# Altium project PCB_Project1.PrjPCB
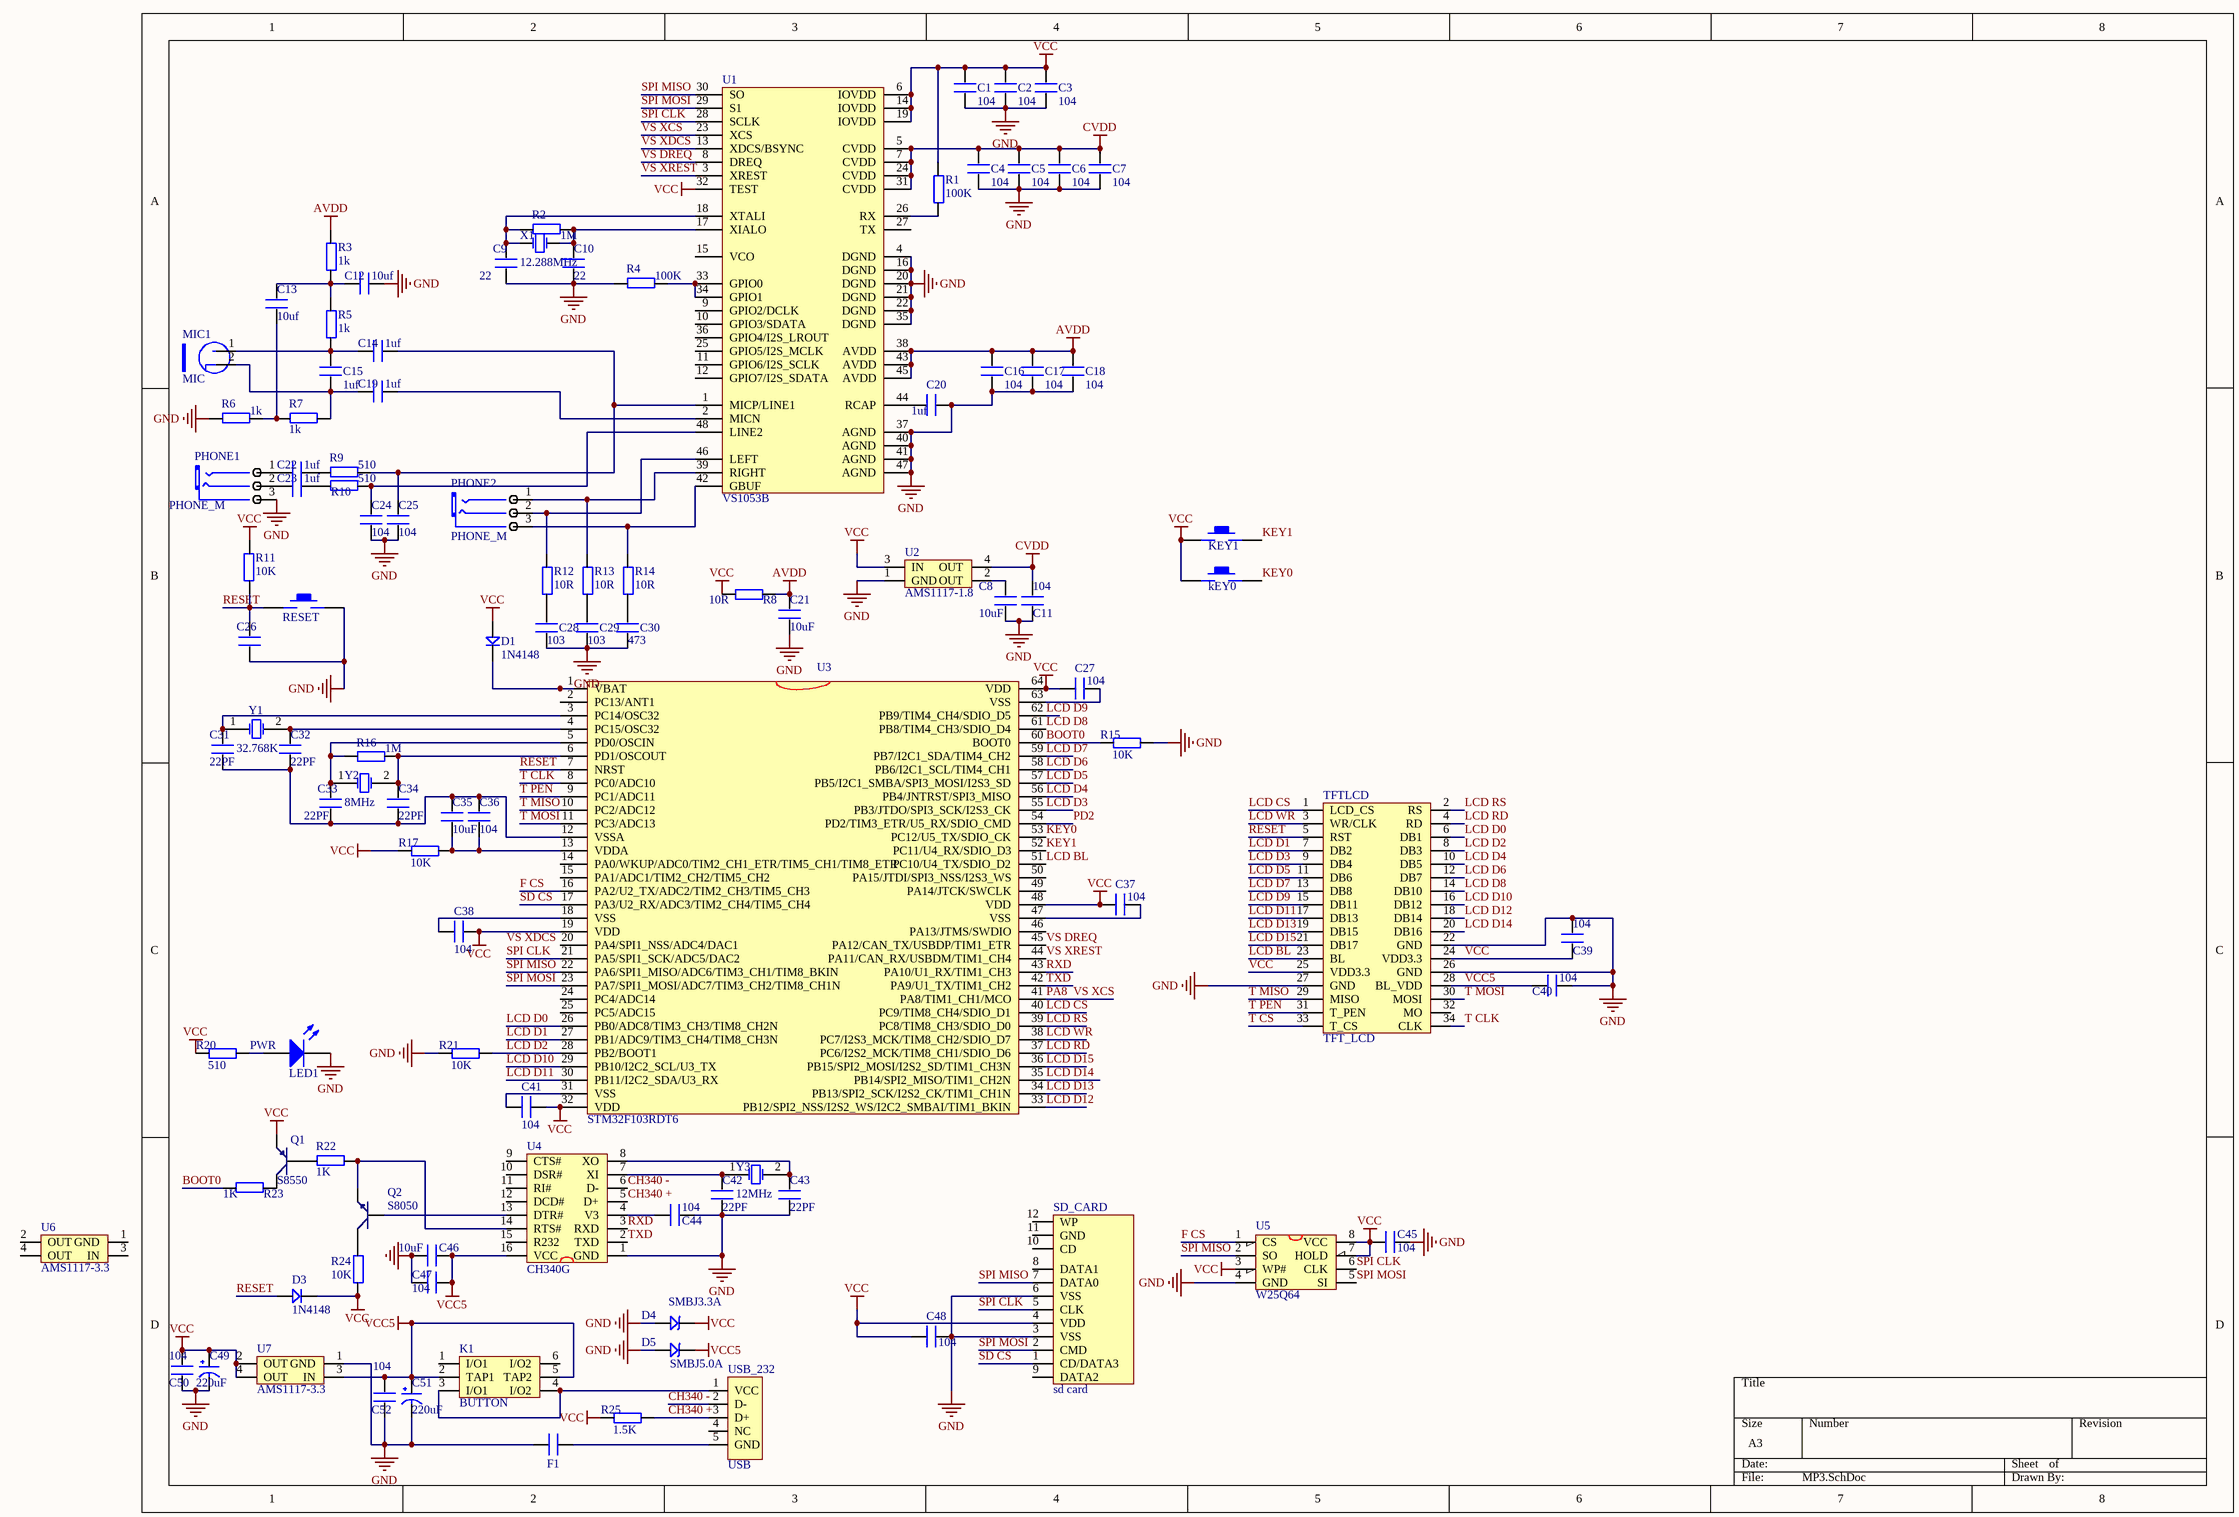
[diagram p0: MP3.SchDoc]
1 sheet, 104 parts. Net scope: global (net labels, ports and power ports of the same name join across sheets).
Board file: MCU.PcbDoc

## Sheet MP3.SchDoc
size A3

### Parts
C1  104  [0603P]
C2  104  [0603P]
C3  104  [0603P]
C4  104  [0603P]
C5  104  [0603P]
C6  104  [0603P]
C7  104  [0603P]
C8  10uF  [0603P]
C9  22  [0603P]
C10  22  [0603P]
C11  104  [0603P]
C12  10uf  [0603P]
C13  10uf  [0603P]
C14  1uf  [0603P]
C15  1uf  [0603P]
C16  104  [0603P]
C17  104  [0603P]
C18  104  [0603P]
C19  1uf  [0603P]
C20  1uf  [0603P]
C21  10uF  [0603P]
C22  1uf  [0603P]
C23  1uf  [0603P]
C24  104  [0603P]
C25  104  [0603P]
C26  10uF  [0603P]  (value not drawn)
C27  104  [0603P]
C28  103  [0603P]
C29  103  [0603P]
C30  473  [0603P]
C31  22PF  [0603P]
C32  22PF  [0603P]
C33  22PF  [0603P]
C34  22PF  [0603P]
C35  10uF  [0603P]
C36  104  [0603P]
C37  104  [0603P]
C38  104  [0603P]
C39  104  [0603P]
C40  104  [0603P]
C41  104  [0603P]
C42  22PF  [0603P]
C43  22PF  [0603P]
C44  104  [0603P]
C45  104  [0603P]
C46  10uF  [0603P]
C47  104  [0603P]
C48  104  [0603P]
C49  220uF  [CC6.56.5]
C50  104  [0603P]
C51  220uF  [CC6.56.5]
C52  104  [0603P]
D1  1N4148  [DIODE_SOP]
D3  1N4148  [DIODE_SOP]
D4  SMBJ3.3A  [SMBJ]
D5  SMBJ5.0A  [SMBJ]
F1  104  [0603P]  (value not drawn)
K1  BUTTON  [BTN8.5*8.5]
kEY0  KEY_M  [KEY_M]  (value not drawn)
KEY1  KEY_M  [KEY_M]  (value not drawn)
MIC1  MIC  [MIC]
PHONE1  PHONE_M  [PHONE_ST]
PHONE2  PHONE_M  [PHONE_ST]
PWR  LED1  [SMDLED]
Q1  S8550  [SOT-23R]
Q2  S8050  [SOT-23R]
R1  100K  [0603P]
R2  1M  [0603P]
R3  1k  [0603P]
R4  100K  [0603P]
R5  1k  [0603P]
R6  1k  [0603P]
R7  1k  [0603P]
R8  10R  [0603P]
R9  510  [0603P]
R10  510  [0603P]
R11  10K  [0603P]
R12  10R  [0603P]
R13  10R  [0603P]
R14  10R  [0603P]
R15  10K  [0603P]
R16  1M  [0603P]
R17  10K  [0603P]
R20  510  [0603P]
R21  10K  [0603P]
R22  1K  [0603P]
R23  1K  [0603P]
R24  10K  [0603P]
R25  1.5K  [0603P]
RESET  KEY_M  [KEY_M]  (value not drawn)
SD_CARD  sd card  [SDCARD_L]
TFTLCD  TFT_LCD  [HDR2X17]
U1  VS1053B  [mTQFP48]
U2  AMS1117-1.8  [AMS1117]
U3  STM32F103RDT6  [LQFP64]
U4  CH340G  [SOP16M]
U5  W25Q64  [SOIC-8]
U6  AMS1117-3.3  [AMS1117]
U7  AMS1117-3.3  [AMS1117]
USB_232  USB  [USB/SM0.8-6H5]
X1  12.288MHz  [XTAL_US]
Y1  32.768K  [R38]
Y2  8MHz  [XTAL_US]
Y3  12MHz  [XTAL_US]

### Nets
AVDD: C16.2 C17.2 C18.2 C21.1 R3.2 R8.2 U1.38(AVDD) U1.43(AVDD) U1.45(AVDD)
CVDD: C4.2 C5.2 C6.2 C7.2 C11.1 U1.5(CVDD) U1.7(CVDD) U1.24(CVDD) U1.31(CVDD) U2.4(OUT)
GND: C1.1 C2.1 C3.1 C4.1 C5.1 C6.1 C7.1 C8.2 C9.2 C10.2 C11.2 C12.1 C16.1 C17.1 C18.1 C20.1 C21.2 C24.1 C25.1 C26.1 C28.1 C29.1 C30.1 C39.1 C40.2 C42.1 C43.1 C44.2 C45.1 C46.1 C47.2 C48.1 C49.2(GND) C50.2 C51.2(GND) C52.2 D4.1 D5.1 F1.2 PHONE1.3(COM) PWR.2(K) R4.2 R6.2 R15.2 R21.1 RESET.2 SD_CARD.3(VSS) SD_CARD.6(VSS) TFTLCD.22(GND) TFTLCD.26(GND) TFTLCD.27(GND) U1.4(DGND) U1.16(DGND) U1.20(DGND) U1.21(DGND) U1.22(DGND) U1.35(DGND) U1.37(AGND) U1.40(AGND) U1.41(AGND) U1.47(AGND) U2.1(GND) U4.1(GND) U5.4(GND) U7.1(GND)
VCC: C1.2 C2.2 C3.2 C27.2 C37.2 C38.1 C39.2 C41.1 C45.2 C48.2 C49.1(VCC) C50.1 D1.1 D3.2 D4.2 kEY0.1 KEY1.1 Q1.1(E) R1.2 R8.1 R11.1 R17.1 R20.1 R24.1 R25.1 SD_CARD.4(VDD) TFTLCD.24(VDD3.3) TFTLCD.25(VDD3.3) U1.6(IOVDD) U1.14(IOVDD) U1.19(IOVDD) U1.32(TEST) U2.3(IN) U3.19(VDD) U3.32(VDD) U3.48(VDD) U3.64(VDD) U5.3(WP#) U5.7(HOLD) U5.8(VCC) U7.2(OUT) U7.4(OUT)
VCC5: C40.1 C46.2 C47.1 C51.1(VCC) C52.1 D5.2 K1.2(TAP1) K1.5(TAP2) TFTLCD.28(BL_VDD) U4.16(VCC) U7.3(IN)
BOOT0: R15.1 R23.2 U3.60(BOOT0)
CH340 +: R25.2 U4.5(D+) USB_232.3(D+)
CH340 -: U4.6(D-) USB_232.2(D-)
F CS: U3.16(PA2/U2_TX/ADC2/TIM2_CH3/TIM5_CH3) U5.1(CS)
KEY0: kEY0.2 U3.53(PC12/U5_TX/SDIO_CK)
KEY1: KEY1.2 U3.52(PC11/U4_RX/SDIO_D3)
LCD BL: TFTLCD.23(BL) U3.51(PC10/U4_TX/SDIO_D2)
LCD CS: TFTLCD.1(LCD_CS) U3.40(PC9/TIM8_CH4/SDIO_D1)
LCD D0: TFTLCD.6(DB1) U3.26(PB0/ADC8/TIM3_CH3/TIM8_CH2N)
LCD D1: TFTLCD.7(DB2) U3.27(PB1/ADC9/TIM3_CH4/TIM8_CH3N)
LCD D2: R21.2 TFTLCD.8(DB3) U3.28(PB2/BOOT1)
LCD D3: TFTLCD.9(DB4) U3.55(PB3/JTDO/SPI3_SCK/I2S3_CK)
LCD D4: TFTLCD.10(DB5) U3.56(PB4/JNTRST/SPI3_MISO)
LCD D5: TFTLCD.11(DB6) U3.57(PB5/I2C1_SMBA/SPI3_MOSI/I2S3_SD)
LCD D6: TFTLCD.12(DB7) U3.58(PB6/I2C1_SCL/TIM4_CH1)
LCD D7: TFTLCD.13(DB8) U3.59(PB7/I2C1_SDA/TIM4_CH2)
LCD D8: TFTLCD.14(DB10) U3.61(PB8/TIM4_CH3/SDIO_D4)
LCD D9: TFTLCD.15(DB11) U3.62(PB9/TIM4_CH4/SDIO_D5)
LCD D10: TFTLCD.16(DB12) U3.29(PB10/I2C2_SCL/U3_TX)
LCD D11: TFTLCD.17(DB13) U3.30(PB11/I2C2_SDA/U3_RX)
LCD D12: TFTLCD.18(DB14) U3.33(PB12/SPI2_NSS/I2S2_WS/I2C2_SMBAI/TIM1_BKIN)
LCD D13: TFTLCD.19(DB15) U3.34(PB13/SPI2_SCK/I2S2_CK/TIM1_CH1N)
LCD D14: TFTLCD.20(DB16) U3.35(PB14/SPI2_MISO/TIM1_CH2N)
LCD D15: TFTLCD.21(DB17) U3.36(PB15/SPI2_MOSI/I2S2_SD/TIM1_CH3N)
LCD RD: TFTLCD.4(RD) U3.37(PC6/I2S2_MCK/TIM8_CH1/SDIO_D6)
LCD RS: TFTLCD.2(RS) U3.39(PC8/TIM8_CH3/SDIO_D0)
LCD WR: TFTLCD.3(WR/CLK) U3.38(PC7/I2S3_MCK/TIM8_CH2/SDIO_D7)
PA8: U1.23(XCS) U3.41(PA8/TIM1_CH1/MCO)  [also labelled VS XCS]
PD2: U3.54(PD2/TIM3_ETR/U5_RX/SDIO_CMD)
RESET: C26.2 D3.1 R11.2 RESET.1 TFTLCD.5(RST) U3.7(NRST)
RXD: U3.43(PA10/U1_RX/TIM1_CH3) U4.3(RXD)
SD CS: SD_CARD.1(CD/DATA3) U3.17(PA3/U2_RX/ADC3/TIM2_CH4/TIM5_CH4)
SPI CLK: SD_CARD.5(CLK) U1.28(SCLK) U3.21(PA5/SPI1_SCK/ADC5/DAC2) U5.6(CLK)
SPI MISO: SD_CARD.7(DATA0) U1.30(SO) U3.22(PA6/SPI1_MISO/ADC6/TIM3_CH1/TIM8_BKIN) U5.2(SO)
SPI MOSI: SD_CARD.2(CMD) U1.29(S1) U3.23(PA7/SPI1_MOSI/ADC7/TIM3_CH2/TIM8_CH1N) U5.5(SI)
T CLK: TFTLCD.34(CLK) U3.8(PC0/ADC10)
T CS: TFTLCD.33(T_CS)
T MISO: TFTLCD.29(MISO) U3.10(PC2/ADC12)
T MOSI: TFTLCD.30(MOSI) U3.11(PC3/ADC13)
T PEN: TFTLCD.31(T_PEN) U3.9(PC1/ADC11)
TXD: U3.42(PA9/U1_TX/TIM1_CH2) U4.2(TXD)
VS DREQ: U1.8(DREQ) U3.45(PA12/CAN_TX/USBDP/TIM1_ETR)
VS XDCS: U1.13(XDCS/BSYNC)
VS XREST: U1.3(XREST) U3.44(PA11/CAN_RX/USBDM/TIM1_CH4)
NetC8_1: C8.1 U2.2(OUT)
NetC9_1: C9.1 R2.2 U1.18(XTALI) X1.1(OSC1)
NetC10_1: C10.1 R2.1 U1.17(XIALO) X1.2(OSC2)
NetC12_2: C12.2 C13.1 R3.1 R5.2
NetC13_2: C13.2 R6.1 R7.2
NetC14_1: C14.1 C25.2 R9.1 U1.1(MICP/LINE1)
NetC14_2: C14.2 C15.1 MIC1.1(VCC) R5.1
NetC15_2: C15.2 C19.2 MIC1.2(GND) R7.1
NetC19_1: C19.1 U1.2(MICN)
NetC20_2: C20.2 U1.44(RCAP)
NetC22_1: C22.1 R9.2
NetC22_2: C22.2 PHONE1.1(CHL)
NetC23_1: C23.1 R10.2
NetC23_2: C23.2 PHONE1.2(CHR)
NetC24_2: C24.2 R10.1 U1.48(LINE2)
NetC27_1: C27.1 U3.63(VSS)
NetC28_2: C28.2 R12.1
NetC29_2: C29.2 R13.1
NetC30_2: C30.2 R14.1
NetC31_1: C31.1 C32.1 C33.1 C34.1 C35.2 C36.2 U3.12(VSSA)
NetC31_2: C31.2 U3.3(PC14/OSC32) Y1.1(OSC1)
NetC32_2: C32.2 U3.4(PC15/OSC32) Y1.2(OSC2)
NetC33_2: C33.2 R16.1 U3.5(PD0/OSCIN) Y2.1(OSC1)
NetC34_2: C34.2 R16.2 U3.6(PD1/OSCOUT) Y2.2(OSC2)
NetC35_1: C35.1 C36.1 R17.2 U3.13(VDDA)
NetC37_1: C37.1 U3.47(VSS)
NetC38_2: C38.2 U3.18(VSS)
NetC41_2: C41.2 U3.31(VSS)
NetC42_2: C42.2 U4.7(XI) Y3.1(OSC1)
NetC43_2: C43.2 U4.8(XO) Y3.2(OSC2)
NetC44_1: C44.1 U4.4(V3)
NetD1_2: D1.2 U3.1(VBAT)
NetF1_1: F1.1 USB_232.5(GND)
NetK1_3: K1.3(I/O1) K1.4(I/O2) USB_232.1(VCC)
NetPHONE2_1: PHONE2.1(CHL) R13.2 U1.39(RIGHT)
NetPHONE2_2: PHONE2.2(CHR) R12.2 U1.46(LEFT)
NetPHONE2_3: PHONE2.3(COM) R14.2 U1.42(GBUF)
NetPWR_1: PWR.1(A) R20.2
NetQ1_2: Q1.2(B) R22.2
NetQ1_3: Q1.3(C) R23.1
NetQ2_1: Q2.1(E) R22.1 U4.14(RTS#)
NetQ2_2: Q2.2(B) U4.13(DTR#)
NetQ2_3: Q2.3(C) R24.2
NetR1_1: R1.1 U1.26(RX)
NetR4_1: R4.1 U1.33(GPIO0) U1.34(GPIO1)

Not connected (* = marked no-connect by the designer): K1 1(I/O1) 6(I/O2); SD_CARD 8(DATA1) 9(DATA2) 10(CD) 11(GND) 12(WP); TFTLCD 32(MO); U1 9(GPIO2/DCLK) 10(GPIO3/SDATA) 11(GPIO6/I2S_SCLK) 12(GPIO7/I2S_SDATA) 15(VCO) 25(GPIO5/I2S_MCLK) 27(TX) 36(GPIO4/I2S_LROUT); U3 2(PC13/ANT1) 14(PA0/WKUP/ADC0/TIM2_CH1_ETR/TIM5_CH1/TIM8_ETR) 15(PA1/ADC1/TIM2_CH2/TIM5_CH2) 20(PA4/SPI1_NSS/ADC4/DAC1) 24(PC4/ADC14) 25(PC5/ADC15) 46(PA13/JTMS/SWDIO) 49(PA14/JTCK/SWCLK) 50(PA15/JTDI/SPI3_NSS/I2S3_WS); U4 9(CTS#) 10(DSR#) 11(RI#) 12(DCD#) 15(R232); U6 1(GND) 2(OUT) 3(IN) 4(OUT); USB_232 4(NC)

### Notes on the sheet
- Labels drawn without touching a wire or pin: VS XDCS

### Library data of the parts
C1-C48 C50 C52 F1 = C
C49 C51 = CAP
D1 D3 = D
D4 D5 = SMBJ: TVS
PWR = LED2: Typical RED, GREEN, YELLOW, AMBER GaAs LED; Published: 8-Jun-2000; LatestRevisionDate: 17-Jul-2002; LatestRevisionNote: Re-released for DXP Platform.; PackageDocument: Feb-2002; PackageReference: 3.2X1.6X1.1; Publisher: Altium Limited
Q1 = PNP: 8550/BCW68
Q2 = NPN: 8050/BCW846/BCW847
R1-R17 R20-R25 = R
U1 = VS1053
U2 U6 U7 = AMS1117
U4 = CH340G: USB2UART
U5 = W25X16: W25X16;SST25VF016;MX25L1605
USB_232 = USB5
X1 Y1-Y3 = XTAL: Crystal Oscillator; Published: 8-Jun-2000; LatestRevisionDate: 17-Jul-2002; LatestRevisionNote: Re-released for DXP Platform.; Publisher: Altium Limited
  Y1: PackageReference: R38; PackageDescription: Crystal, Thru-Hole; 2 Leads; Body 3.1 x 8.2 mm (Dia.xH)